# Altium schematic sheet ay.SchDoc: AY-3-8913
size A4
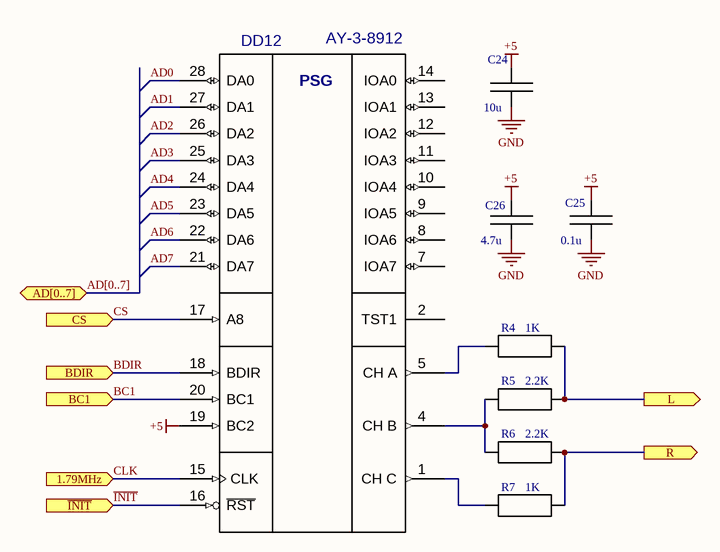
[diagram p0: ay.SchDoc]

## Parts
C24  10u  [CAP 5.5x3.15]
C25  0.1u  [CAP 4x2.5]
C26  4.7u  [CAP 5.5x3.15]
DD12  AY-3-8912  [DIP28]
R4  1K  [Axial Res 0.25]
R5  2.2K  [Axial Res 0.25]
R6  2.2K  [Axial Res 0.25]
R7  1K  [Axial Res 0.25]

## Ports
1.79MHz (in), AD[0..7] (bidir), BC1 (in), BDIR (in), CS (in), L (out), R (out), ~{INIT} (in)

## Nets
+5: C24.2 C25.2 C26.2 DD12.3(Vcc) DD12.19(BC2)
GND: C24.1 C25.1 C26.1 DD12.6(Vss)
AD0: DD12.28(DA0)
AD1: DD12.27(DA1)
AD2: DD12.26(DA2)
AD3: DD12.25(DA3)
AD4: DD12.24(DA4)
AD5: DD12.23(DA5)
AD6: DD12.22(DA6)
AD7: DD12.21(DA7)
BC1: DD12.20(BC1) ; port BC1
BDIR: DD12.18(BDIR) ; port BDIR
CLK: DD12.15(CLK) ; port 1.79MHz
CS: DD12.17(A8) ; port CS
~{INIT}: DD12.16(~{RST}) ; port ~{INIT}
L: R4.1 R5.1 ; port L
R: R6.1 R7.1 ; port R
NetDD12_1: DD12.1(CH_C) R7.2
NetDD12_4: DD12.4(CH_B) R5.2 R6.2
NetDD12_5: DD12.5(CH_A) R4.2

Not connected (* = marked no-connect by the designer): DD12 2(TST1) 7(IOA7) 8(IOA6) 9(IOA5) 10(IOA4) 11(IOA3) 12(IOA2) 13(IOA1) 14(IOA0)

## Buses and harness runs
bus AD[0..7] = port AD[0..7]

## Notes on the sheet
- (in symbol AY-3-8912) PSG

## Library data of the parts
C24-C26 = Cap: Murata ceramic capacitor
R4-R7 = Axial Resistor 0.25
DD12 = AY-3-8912: Value: *